# Altium schematic sheet TIVA_3.SchDoc
size A3
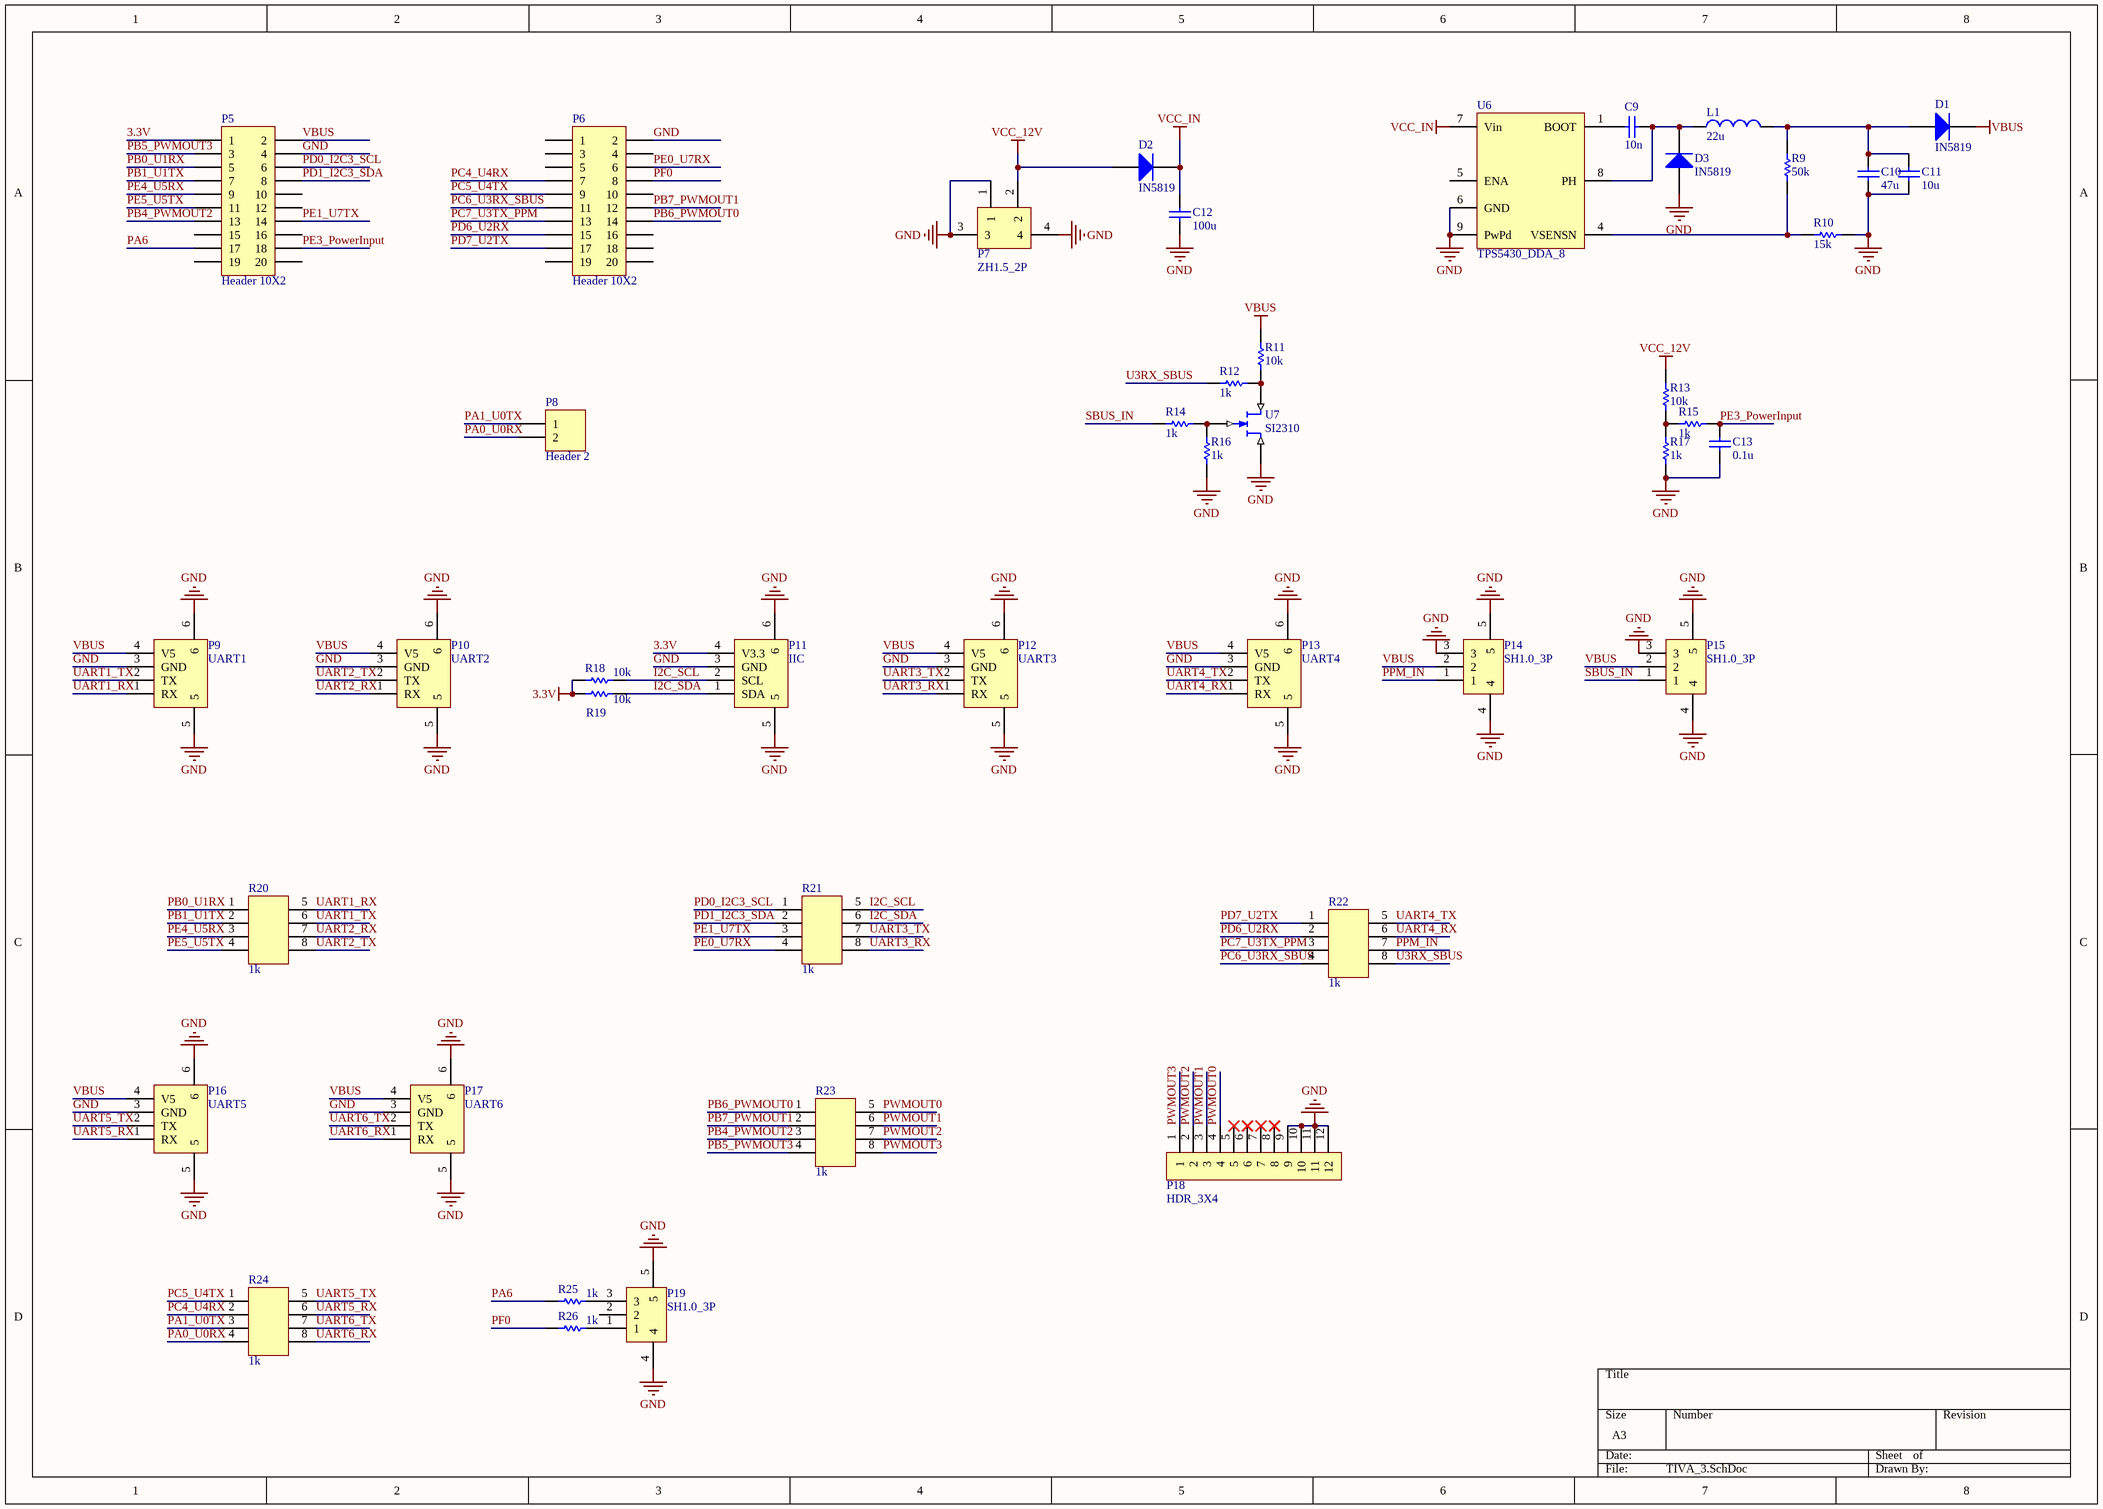
[diagram p0: TIVA_3.SchDoc]

## Parts
C9  10n  [C_0805]
C10  47u  [C_0805]
C11  10u  [C_0805]
C12  100u  [C_1210]
C13  0.1u  [C_0805]
D1  IN5819  [SMA_SS14]
D2  IN5819  [SMA_SS14]
D3  IN5819  [SMA_SS14]
L1  22u  [L_06030]
P5  Header 10X2  [HDR2X10]
P6  Header 10X2  [HDR2X10]
P7  ZH1.5_2P  [ZH1.5_2P]
P8  Header 2  [HDR1X2]
P9  UART1  [SH1.0_4p]
P10  UART2  [SH1.0_4p]
P11  IIC  [SH1.0_4p]
P12  UART3  [SH1.0_4p]
P13  UART4  [SH1.0_4p]
P14  SH1.0_3P  [SH1.0_3P]
P15  SH1.0_3P  [SH1.0_3P]
P16  UART5  [SH1.0_4p]
P17  UART6  [SH1.0_4p]
P18  HDR_3X4  [HDR3X4]
P19  SH1.0_3P  [SH1.0_3P]
R9  50k  [R_0805]
R10  15k  [R_0805]
R11  10k  [R_0805]
R12  1k  [R_0805]
R13  10k  [R_0805]
R14  1k  [R_0805]
R15  1k  [R_0805]
R16  1k  [R_0805]
R17  1k  [R_0805]
R18  10k  [R_0805]
R19  10k  [R_0805]
R20  1k  [HDR_R_4]
R21  1k  [HDR_R_4]
R22  1k  [HDR_R_4]
R23  1k  [HDR_R_4]
R24  1k  [HDR_R_4]
R25  1k  [R_0805]
R26  1k  [R_0805]
U6  TPS5430_DDA_8  [DDA8_3P1X2P4]
U7  SI2310  [SOT_23]

## Nets
3.3V: P5.1 P11.4(V3.3) R18.2 R19.2
GND: C10.1 C11.1 C12.1 C13.1 D3.1(A) P5.4 P6.2 P7.1 P7.3 P7.4 P9.3(GND) P9.5 P9.6 P10.3(GND) P10.5 P10.6 P11.3(GND) P11.5 P11.6 P12.3(GND) P12.5 P12.6 P13.3(GND) P13.5 P13.6 P14.3 P14.4 P14.5 P15.3 P15.4 P15.5 P16.3(GND) P16.5 P16.6 P17.3(GND) P17.5 P17.6 P18.9 P18.10 P18.11 P18.12 P19.4 P19.5 R10.1 R16.2 R17.1 U6.6(GND) U6.9(PwPd) U7.2(S)
VBUS: D1.2(K) P5.2 P9.4(V5) P10.4(V5) P12.4(V5) P13.4(V5) P14.2 P15.2 P16.4(V5) P17.4(V5) R11.2
VCC_12V: D2.1(A) P7.2 R13.2
VCC_IN: C12.2 D2.2(K) U6.7(Vin)
I2C_SCL: P11.2(SCL) R18.1 R21.5
I2C_SDA: P11.1(SDA) R19.1 R21.6
PA0_U0RX: P8.2 R24.4
PA1_U0TX: P8.1 R24.3
PA6: P5.17 R25.1
PB0_U1RX: P5.5 R20.1
PB1_U1TX: P5.7 R20.2
PB4_PWMOUT2: P5.13 R23.3
PB5_PWMOUT3: P5.3 R23.4
PB6_PWMOUT0: P6.14 R23.1
PB7_PWMOUT1: P6.12 R23.2
PC4_U4RX: P6.7 R24.2
PC5_U4TX: P6.9 R24.1
PC6_U3RX_SBUS: P6.11 R22.4
PC7_U3TX_PPM: P6.13 R22.3
PD0_I2C3_SCL: P5.6 R21.1
PD1_I2C3_SDA: P5.8 R21.2
PD6_U2RX: P6.15 R22.2
PD7_U2TX: P6.17 R22.1
PE0_U7RX: P6.6 R21.4
PE1_U7TX: P5.14 R21.3
PE3_PowerInput: C13.2 P5.18 R15.1
PE4_U5RX: P5.9 R20.3
PE5_U5TX: P5.11 R20.4
PF0: P6.8 R26.1
PPM_IN: P14.1 R22.7
PWMOUT0: P18.4 R23.5
PWMOUT1: P18.3 R23.6
PWMOUT2: P18.2 R23.7
PWMOUT3: P18.1 R23.8
SBUS_IN: P15.1 R14.2
U3RX_SBUS: R12.2 R22.8
UART1_RX: P9.1(RX) R20.5
UART1_TX: P9.2(TX) R20.6
UART2_RX: P10.1(RX) R20.7
UART2_TX: P10.2(TX) R20.8
UART3_RX: P12.1(RX) R21.8
UART3_TX: P12.2(TX) R21.7
UART4_RX: P13.1(RX) R22.6
UART4_TX: P13.2(TX) R22.5
UART5_RX: P16.1(RX) R24.6
UART5_TX: P16.2(TX) R24.5
UART6_RX: P17.1(RX) R24.8
UART6_TX: P17.2(TX) R24.7
NetC9_1: C9.1 D3.2(K) L1.1 U6.8(PH)
NetC9_2: C9.2 U6.1(BOOT)
NetC10_2: C10.2 C11.2 D1.1(A) L1.2 R9.2
NetP19_1: P19.1 R26.2
NetP19_3: P19.3 R25.2
NetR9_1: R9.1 R10.2 U6.4(VSENSN)
NetR11_1: R11.1 R12.1 U7.3(D)
NetR13_1: R13.1 R15.2 R17.2
NetR14_1: R14.1 R16.1 U7.1(G)

Not connected (* = marked no-connect by the designer): P5 10 12 15 16 19 20; P6 1 3 4 5 10 16 18 19 20; P18 5* 6* 7* 8*; P19 2; U6 5(ENA)

## Library data of the parts
C9-C11 C13 = C_0805
C12 = C_1210
L1 = L_06030
P5 P6 = Header 10X2: Header, 10-Pin, Dual row; LatestRevisionDate: 17-Jul-2002; LatestRevisionNote: Re-released for DXP Platform.; Publisher: Altium Limited
P8 = Header 2: Header, 2-Pin; LatestRevisionDate: 17-Jul-2002; LatestRevisionNote: Re-released for DXP Platform.; Publisher: Altium Limited
P9 P10 P12 P13 P16 P17 = UART
R9-R19 R25 R26 = R_0805
R20-R24 = R_4
U6 = TPS5430_DDA_8: Imported; Vendor: Texas Instruments; PACKAGE_DESIGNATOR: DDA; PIN_COUNT: 8; FAMILY_NAME: STEP-DOWN REGULATOR; INDUSTRY_STD_PKG_TYPE: SO PowerPAD; Manufacturer_Part_Number: tps5430_dda_8; GENERIC_PART_NUMBER: TPS5430; Manufacturer: Texas Instruments; Datasheet_URL: http://www.ti.com/lit/gpn/TPS5430; Value: Value; Type: Type; RefDes: RefDes
U7 = SI2310_2